# Altium schematic sheet StereoHeadphoneDriver.SchDoc
size Tabloid; Size: 11x17; Sheet_Name: Stereo Headphone Driver
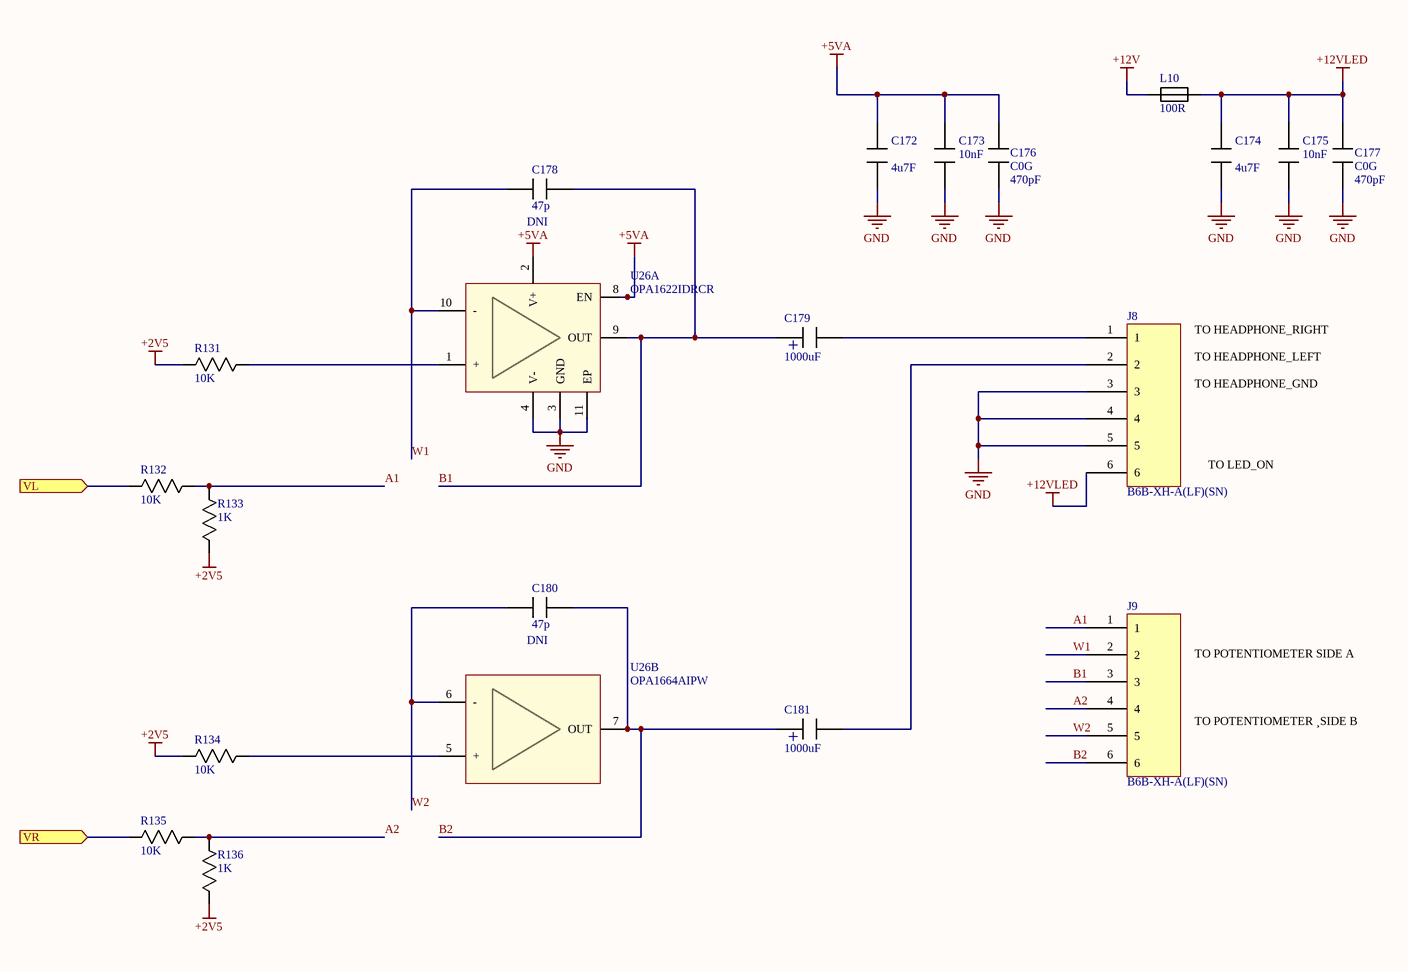
[diagram p0: StereoHeadphoneDriver.SchDoc]

## Parts
C172  value 4u7F  [0805]  (hidden comment: Capacitor)
C173  value 10nF  [0603]  (hidden comment: Capacitor)
C174  value 4u7F  [0805]  (hidden comment: Capacitor)
C175  value 10nF  [0603]  (hidden comment: Capacitor)
C176  value 470pF  Type: C0G  [0603]  (hidden comment: Capacitor)
C177  value 470pF  Type: C0G  [0603]  (hidden comment: Capacitor)
C178  value 47p  note: DNI  [0402]  (hidden comment: Capacitor)
C179  value 1000uF  [CAP_RAD_SMD_DIA315]  (hidden comment: Capacitor_Polarized)
C180  value 47p  note: DNI  [0402]  (hidden comment: Capacitor)
C181  value 1000uF  [CAP_RAD_SMD_DIA315]  (hidden comment: Capacitor_Polarized)
J8  Mfg_PN: B6B-XH-A(LF)(SN)  [CONN_6_HEADER]  (hidden comment: CON_XH_JST_6pins)
J9  Mfg_PN: B6B-XH-A(LF)(SN)  [CONN_6_HEADER]  (hidden comment: CON_XH_JST_6pins)
L10  value 100R  [0603]  (hidden comment: Ferrite)
R131  value 10K  [0402]  (hidden comment: Resistor)
R132  value 10K  [0402]  (hidden comment: Resistor)
R133  value 1K  [0402]  (hidden comment: Resistor)
R134  value 10K  [0402]  (hidden comment: Resistor)
R135  value 10K  [0402]  (hidden comment: Resistor)
R136  value 1K  [0402]  (hidden comment: Resistor)
U26  Mfg_PN: OPA1622IDRCR  [10-VFDFN]  (hidden comment: OPA1622)  (parts A,B of 2)

## Ports
VL (in), VR (in)

## Nets
+2V5: R131.2 R133.2 R134.2 R136.2
+5VA: C172.1 C173.1 C176.2 U26.2(V+) U26.8(EN)
+12V: L10.1
+12VLED: C174.1 C175.1 C177.2 J8.6 L10.2
GND: C172.2 C173.2 C174.2 C175.2 C176.1 C177.1 J8.3 J8.4 J8.5 U26.3(GND) U26.4(V-) U26.11(EP)
A1: J9.1 R132.1 R133.1
A2: J9.4 R135.1 R136.1
B1: C178.2 C179.+ J9.3 U26.9(OUT)
B2: C180.2 C181.+ J9.6 U26.7(OUT)
VL: R132.2 ; port VL
VR: R135.2 ; port VR
W1: C178.1 J9.2 U26.10(-)
W2: C180.1 J9.5 U26.6(-)
NetC179_-: C179.- J8.1
NetC181_-: C181.- J8.2
NetR131_1: R131.1 U26.1(+)
NetR134_1: R134.1 U26.5(+)

## Notes on the sheet
- TO HEADPHONE_RIGHT
- TO HEADPHONE_LEFT
- TO HEADPHONE_GND
- TO LED_ON
- TO POTENTIOMETER SIDE A
- TO POTENTIOMETER ¸SIDE B
- Sheet Name
- Project Title
- Size
- Group
- Revision
- Date :
- Filename :
- Sheet
- Authors :
- of

## Library data of the parts
C172 C174 = Capacitor: Mfg: Samsung; Mfg_PN: CL21A475KAQNNNG; HelpURL: *; NI: *; Supplier1: Digikey; Supplier1_PN: 1276-6462-1-ND; Tolerance: *; Type: *; Rating: *
C173 C175 = Capacitor: Mfg: Murata; Mfg_PN: CL05B103KO5NNNC; HelpURL: *; NI: *; Supplier1: Digikey; Supplier1_PN: 1276-1051-1-ND; Tolerance: *; Type: *; Rating: *
C176 C177 = Capacitor: Mfg: Samsung; Mfg_PN: CL10C471JB8NCNC; HelpURL: *; NI: *; Supplier1: Digikey; Supplier1_PN: 1276-2302-1-ND; Tolerance: *; Rating: *
C178 C180 = Capacitor: Mfg: Murata; Mfg_PN: GRM1885C1H222JA01D; HelpURL: *; NI: *; Supplier1: Digikey; Supplier1_PN: 490-1459-1-ND; Tolerance: *; Type: *; Rating: *
C179 = Capacitor_Polarized_1: Capacitor; Mfg: Nichicon; Mfg_PN: UWT0J102MNL1GS; HelpURL: *; NI: *; Supplier1: Digikey; Supplier1_PN: 493-2160-1-ND; Tolerance: *; Type: *; Rating: *
C181 = Capacitor_Polarized_1: Capacitor; Mfg: Nichicon; Mfg_PN: UWT1E221MNL1GS; HelpURL: *; NI: *; Supplier1: Digikey; Supplier1_PN: 493-2192-1-ND; Tolerance: *; Type: *; Rating: *
J8 J9 = CON_XH_JST_6pins: Mfg: JST Sales America Inc.; Supplier1: Digikey
L10 = Ferrite: Mfg: Bourns; Mfg_PN: MH2029-101Y; Rating: 1A; HelpURL: *; NI: *; Supplier1: Digikey; Supplier1_PN: MH2029-101YCT-ND; Tolerance: *; Type: *
R131-R136 = Resistor: Mfg: Yageo; Mfg_PN: 311-10GRCT-ND; HelpURL: *; NI: *; Supplier1: Digikey; Supplier1_PN: 311-100KGRCT-ND; Type: *; Rating: *; Tolerance: *
U26 = OPA1622: Dual amplifier (headphone driver); Mfg: Texas Instruments; HelpURL: *; NI: *; Rating: *; Supplier1: Digikey; Supplier1_PN: 296-45038-1-ND; Tolerance: *; Value: *